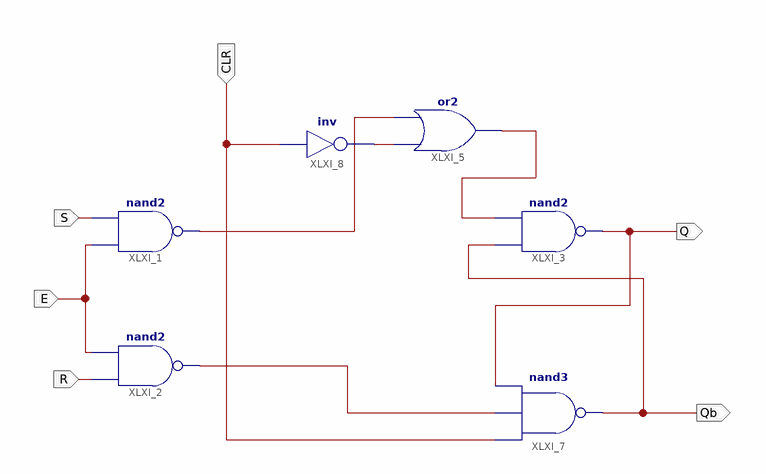
[diagram p0: schematic sheet 1]
// Xilinx ISE schematic SR_IMPROVED.sch (spartan3a) as structural Verilog: 6 symbols, 6 ports
module SR_IMPROVED (
  input  E,
  input  CLR,
  input  S,
  input  R,
  output Q,
  output Qb
);

  wire XLXN_3, XLXN_8, XLXN_9, XLXN_12;

  nand XLXI_1 (XLXN_3, E, S);
  nand XLXI_2 (XLXN_12, R, E);
  nand XLXI_3 (Q, Qb, XLXN_9);
  or XLXI_5 (XLXN_9, XLXN_8, XLXN_3);
  nand XLXI_7 (Qb, CLR, XLXN_12, Q);
  not XLXI_8 (XLXN_8, CLR);
endmodule
